# EAGLE schematic Nusbio 2 - IC2 Extension (EAGLE 9.6.2)
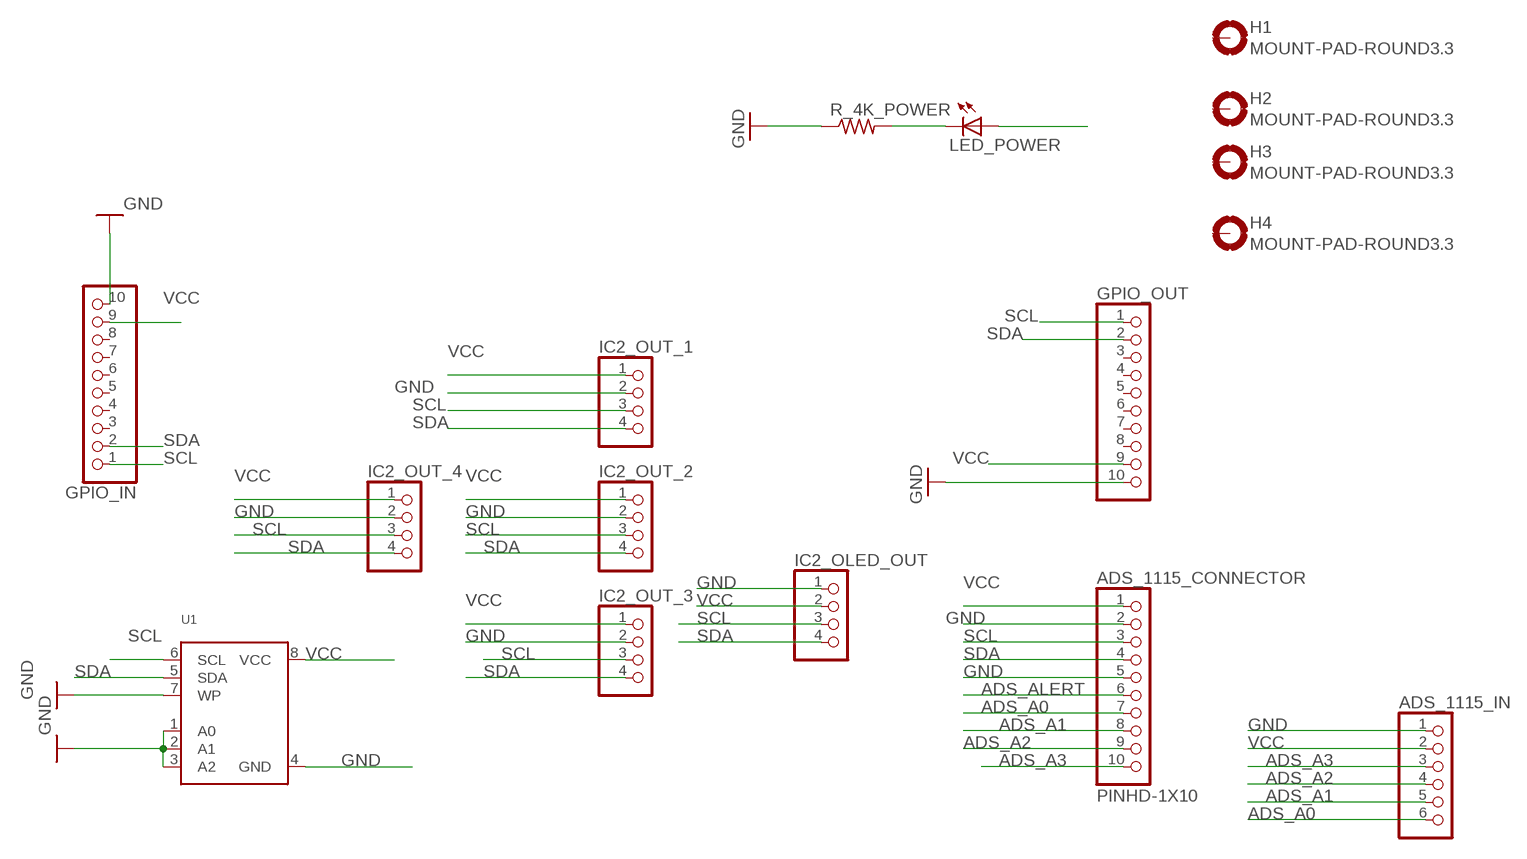
[diagram p0: schematic, sheet 1]

## Parts
ADS_1115_CONNECTOR  PINHD-1X10  [1X10-BIG]
ADS_1115_IN  PINHD-1X6  [1X06]
GPIO_IN  PINHD-1X10  [1X10-BIG]
GPIO_OUT  PINHD-1X10  [1X10-BIG]
H1  MOUNT-PAD-ROUND3.3  [3,3-PAD]
H2  MOUNT-PAD-ROUND3.3  [3,3-PAD]
H3  MOUNT-PAD-ROUND3.3  [3,3-PAD]
H4  MOUNT-PAD-ROUND3.3  [3,3-PAD]
IC2_OLED_OUT  PINHD-1X4  [1X04]
IC2_OUT_1  PINHD-1X4  [1X04]
IC2_OUT_2  PINHD-1X4  [1X04]
IC2_OUT_3  PINHD-1X4  [1X04]
IC2_OUT_4  PINHD-1X4  [1X04]
LED_POWER  LEDSMT1206  [1206]
R_4K_POWER  R-US_R1206  [R1206]
U1  EEPROM_I2C_SOIC8_GENERIC  [SOIC8_150MIL]

## Nets
ADS_A0: ADS_1115_CONNECTOR.7 ADS_1115_IN.6
ADS_A1: ADS_1115_CONNECTOR.8 ADS_1115_IN.5
ADS_A2: ADS_1115_CONNECTOR.9 ADS_1115_IN.4
ADS_A3: ADS_1115_CONNECTOR.10 ADS_1115_IN.3
ADS_ALERT: ADS_1115_CONNECTOR.6
GND: ADS_1115_CONNECTOR.2 ADS_1115_CONNECTOR.5 ADS_1115_IN.1 GPIO_IN.10 GPIO_OUT.10 IC2_OLED_OUT.1 IC2_OUT_1.2 IC2_OUT_2.2 IC2_OUT_3.2 IC2_OUT_4.2 R_4K_POWER.1 U1.1(A0) U1.2(A1) U1.3(A2) U1.4(GND) U1.7(WP)
N$2: LED_POWER.C R_4K_POWER.2
SCL: ADS_1115_CONNECTOR.3 GPIO_IN.1 GPIO_OUT.1 IC2_OLED_OUT.3 IC2_OUT_1.3 IC2_OUT_2.3 IC2_OUT_3.3 IC2_OUT_4.3 U1.6(SCL)
SDA: ADS_1115_CONNECTOR.4 GPIO_IN.2 GPIO_OUT.2 IC2_OLED_OUT.4 IC2_OUT_1.4 IC2_OUT_2.4 IC2_OUT_3.4 IC2_OUT_4.4 U1.5(SDA)
VCC: ADS_1115_CONNECTOR.1 ADS_1115_IN.2 GPIO_IN.9 GPIO_OUT.9 IC2_OLED_OUT.2 IC2_OUT_1.1 IC2_OUT_2.1 IC2_OUT_3.1 IC2_OUT_4.1 LED_POWER.A U1.8(VCC)
Unconnected: GPIO_IN.3 GPIO_IN.4 GPIO_IN.5 GPIO_IN.6 GPIO_IN.7 GPIO_IN.8 GPIO_OUT.3 GPIO_OUT.4 GPIO_OUT.5 GPIO_OUT.6 GPIO_OUT.7 GPIO_OUT.8 H1.B3,3(MOUNT) H2.B3,3(MOUNT) H3.B3,3(MOUNT) H4.B3,3(MOUNT)

## Library data of the parts
ADS_1115_CONNECTOR GPIO_IN GPIO_OUT = adafruit:PINHD-1X10: Pin header 1x10 0.1" spacing With round pins
ADS_1115_IN = adafruit:PINHD-1X6: PIN HEADER
H1-H4 = holes:MOUNT-PAD-ROUND: MOUNTING PAD, round
IC2_OLED_OUT IC2_OUT_1-IC2_OUT_4 = pinhead:PINHD-1X4: PIN HEADER
LED_POWER = adafruit:LED: LED OSRAM: - CHIPLED LG R971, LG N971, LY N971, LG Q971, LY Q971, LO R971, LY R971 LH N974, LH R974 LS Q976, LO Q976, LY Q976 LO Q996 - Hyper CHIPLED LW Q18S LB Q993, LB Q99A, LB R99A - SideLED LS A670, LO A670, LY A670, LG A670, LP A670 LB A673, LV A673, LT A673, LW A673 LH A674 LY A675 LS A676, LA A676, LO A676, LY A676, LW A676 LS A679, LY A679, LG A679 - Hyper Micro SIDELED® LS Y876, LA Y876, LO Y876, LY Y876 LT Y87S - SmartLED LW L88C, LW L88S LB L89C, LB L89S, LG L890 LS L89K, LO L89K, LY L89K LS L896, LA L896, LO L896, LY L896 - TOPLED LS T670, LO T670, LY T670, LG T670, LP T670 LSG T670, LSP T670, LSY T670, LOP T670, LYG T670 LG T671, LOG T671, LSG T671 LB T673, LV T673, LT T673, LW T673 LH T674 LS T676, LA T676, LO T676, LY T676, LB T676, LH T676, LSB T676, LW T676 LB T67C, LV T67C, LT T67C, LS T67K, LO T67K, LY T67K, LW E67C LS E67B, LA E67B, LO E67B, LY E67B, LB E67C, LV E67C, LT E67C LW T67C LS T679, LY T679, LG T679 LS T770, LO T770, LY T770, LG T770, LP T770 LB T773, LV T773, LT T773, LW T773 LH T774 LS E675, LA E675, LY E675, LS T675 LS T776, LA T776, LO T776, LY T776, LB T776 LHGB T686 LT T68C, LB T68C - Hyper Mini TOPLED® LB M676 - Mini TOPLED Santana® LG M470 LS M47K, LO M47K, LY M47K Source: http://www.osram.convergy.de/
R_4K_POWER = adafruit:R-US_: RESISTOR, American symbol
U1 = microbuilder:EEPROM_I2C_SOIC8_GENERIC: Note: The same pinout is used for many I2C EEPROMs in SOIC8(150mil) from a variety of manufacturers and in various sizes. Examples: 16K (2K x 8 Bit) I2C EEPROM 1.7-5.5V, 400KHz, -40°C-85°C Digikey: CAT24C16WI-GT3CT-ND 256K (32K x 8 Bit) I2C EEPROM 1.7-5.5V, 400KHz, -40°C-85°C Digikey: 24AA256-I/SN-ND